# Altium project ESP+CM3.PrjPcb
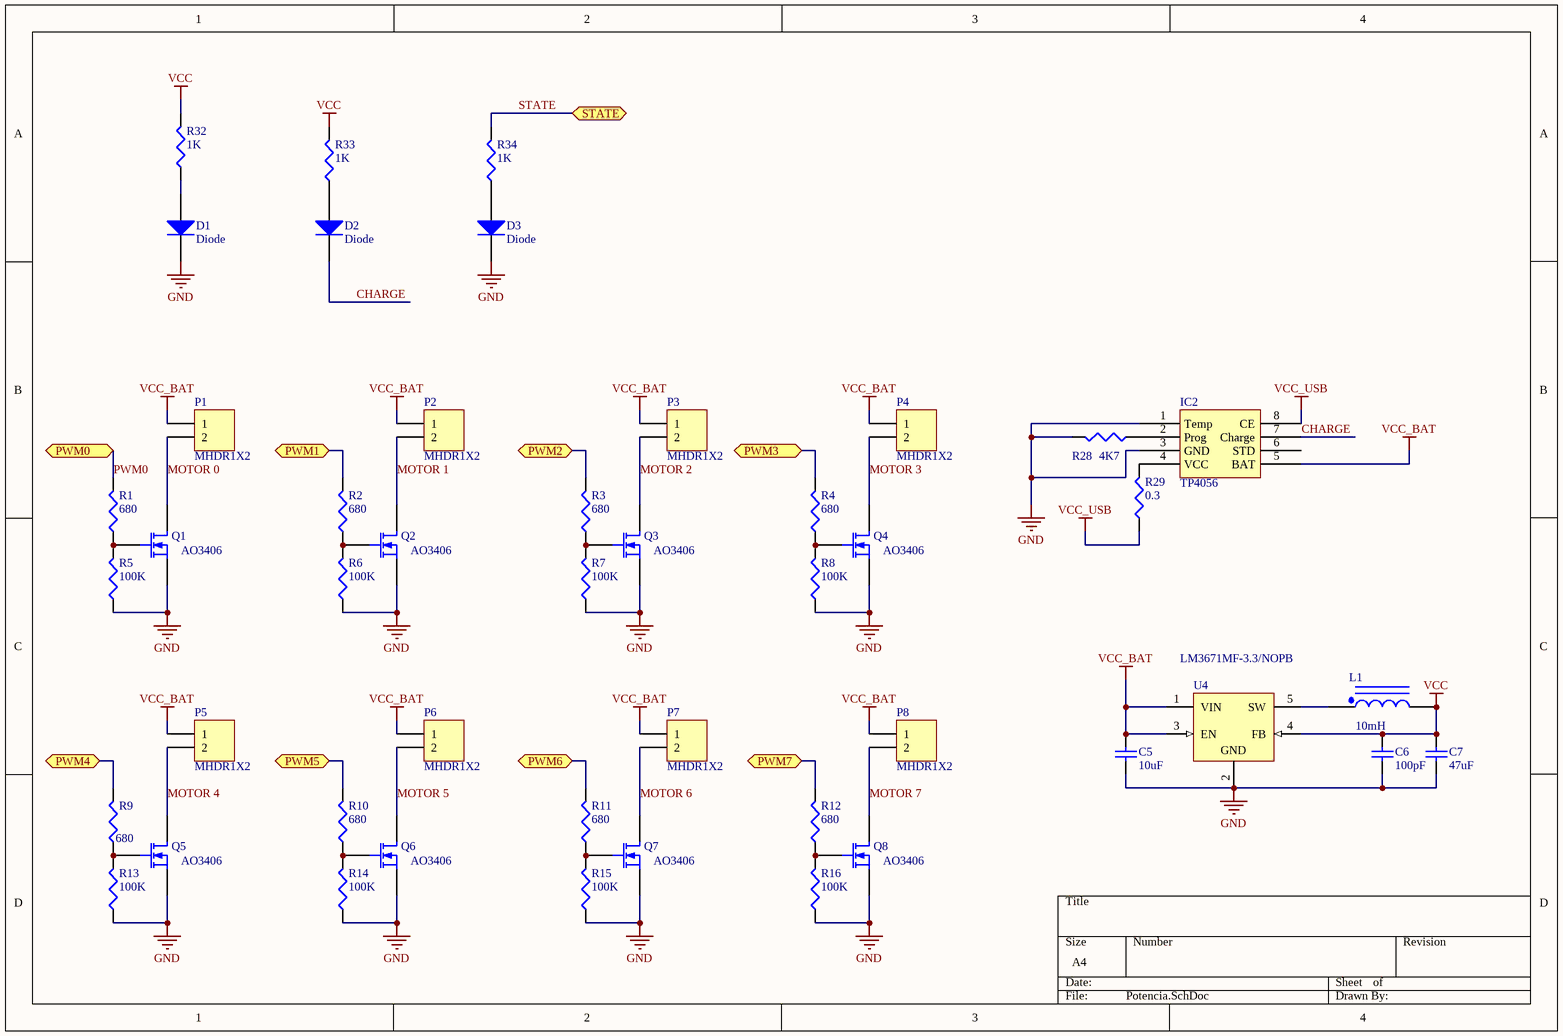
[diagram p0: Potencia.SchDoc]
2 sheets, 74 parts. Net scope: flat (ports and power ports of the same name join across sheets).
Board file: PCB_Final.PcbDoc
Sheets:
  Potencia.SchDoc
  Esquematico.SchDoc

## Sheet Potencia.SchDoc
size A4

### Parts
C5  value 10uF  [6-0805_L]  (hidden comment: Cap)
C6  value 100pF  [6-0805_L]  (hidden comment: Cap)
C7  value 47uF  [6-0805_L]  (hidden comment: Cap)
D1  Diode  [LED-0805]
D2  Diode  [LED-0805]
D3  Diode  [LED-0805]
IC2  TP4056  [SOIC127P600X175-8AN]
L1  value 10mH  [Inductor CD43]  (hidden comment: Inductor Iron Dot)
P1  MHDR1X2  [MHDR1X2]
P2  MHDR1X2  [MHDR1X2]
P3  MHDR1X2  [MHDR1X2]
P4  MHDR1X2  [MHDR1X2]
P5  MHDR1X2  [MHDR1X2]
P6  MHDR1X2  [MHDR1X2]
P7  MHDR1X2  [MHDR1X2]
P8  MHDR1X2  [MHDR1X2]
Q1  AO3406  [SOT23-3]
Q2  AO3406  [SOT23-3]
Q3  AO3406  [SOT23-3]
Q4  AO3406  [SOT23-3]
Q5  AO3406  [SOT23-3]
Q6  AO3406  [SOT23-3]
Q7  AO3406  [SOT23-3]
Q8  AO3406  [SOT23-3]
R1  value 680  [6-0805_N]  (hidden comment: Res3)
R2  value 680  [6-0805_N]  (hidden comment: Res3)
R3  value 680  [6-0805_N]  (hidden comment: Res3)
R4  value 680  [6-0805_N]  (hidden comment: Res3)
R5  value 100K  [6-0805_N]  (hidden comment: Res3)
R6  value 100K  [6-0805_N]  (hidden comment: Res3)
R7  value 100K  [6-0805_N]  (hidden comment: Res3)
R8  value 100K  [6-0805_N]  (hidden comment: Res3)
R9  value 680  [6-0805_N]  (hidden comment: Res3)
R10  value 680  [6-0805_N]  (hidden comment: Res3)
R11  value 680  [6-0805_N]  (hidden comment: Res3)
R12  value 680  [6-0805_N]  (hidden comment: Res3)
R13  value 100K  [6-0805_N]  (hidden comment: Res3)
R14  value 100K  [6-0805_N]  (hidden comment: Res3)
R15  value 100K  [6-0805_N]  (hidden comment: Res3)
R16  value 100K  [6-0805_N]  (hidden comment: Res3)
R28  value 4K7  [6-0805_N]  (hidden comment: Res3)
R29  value 0.3  [C1206]  (hidden comment: Res3)
R32  value 1K  [6-0805_N]  (hidden comment: Res3)
R33  value 1K  [6-0805_N]  (hidden comment: Res3)
R34  value 1K  [6-0805_N]  (hidden comment: Res3)
U4  LM3671MF-3.3/NOPB  [MF05A_N]

### Ports
PWM0, PWM1, PWM2, PWM3, PWM4, PWM5, PWM6, PWM7, STATE

### Nets
GND: C5.1 C6.1 C7.1 D1.2(K) D3.2(K) IC2.1(Temp) IC2.3(GND) Q1.3(S) Q2.3(S) Q3.3(S) Q4.3(S) Q5.3(S) Q6.3(S) Q7.3(S) Q8.3(S) R5.1 R6.1 R7.1 R8.1 R13.1 R14.1 R15.1 R16.1 R28.2 U4.2(GND)
VCC: C6.2 C7.2 L1.2 R32.2 R33.2 U4.4(FB)
VCC_BAT: C5.2 IC2.5(BAT) P1.1 P2.1 P3.1 P4.1 P5.1 P6.1 P7.1 P8.1 U4.1(VIN) U4.3(EN)
VCC_USB: IC2.8(CE) R29.1
CHARGE: D2.2(K) IC2.7(Charge)
MOTOR 0: P1.2 Q1.1(D)
MOTOR 1: P2.2 Q2.1(D)
MOTOR 2: P3.2 Q3.1(D)
MOTOR 3: P4.2 Q4.1(D)
MOTOR 4: P5.2 Q5.1(D)
MOTOR 5: P6.2 Q6.1(D)
MOTOR 6: P7.2 Q7.1(D)
MOTOR 7: P8.2 Q8.1(D)
PWM0: R1.2 ; port PWM0
PWM1: R2.2 ; port PWM1
PWM2: R3.2 ; port PWM2
PWM3: R4.2 ; port PWM3
PWM4: R9.2 ; port PWM4
PWM5: R10.2 ; port PWM5
PWM6: R11.2 ; port PWM6
PWM7: R12.2 ; port PWM7
STATE: R34.2 ; port STATE
NetD1_1: D1.1(A) R32.1
NetD2_1: D2.1(A) R33.1
NetD3_1: D3.1(A) R34.1
NetIC2_2: IC2.2(Prog) R28.1
NetIC2_4: IC2.4(VCC) R29.2
NetL1_1: L1.1 U4.5(SW)
NetQ1_2: Q1.2(G) R1.1 R5.2
NetQ2_2: Q2.2(G) R2.1 R6.2
NetQ3_2: Q3.2(G) R3.1 R7.2
NetQ4_2: Q4.2(G) R4.1 R8.2
NetQ5_2: Q5.2(G) R9.1 R13.2
NetQ6_2: Q6.2(G) R10.1 R14.2
NetQ7_2: Q7.2(G) R11.1 R15.2
NetQ8_2: Q8.2(G) R12.1 R16.2

Not connected (* = marked no-connect by the designer): IC2 6(STD)

### Library data of the parts
C5-C7 = Cap: Capacitor; Published: 8-Jun-2000; LatestRevisionDate: 17-Jul-2002; LatestRevisionNote: Re-released for DXP Platform.; PackageReference: RAD-0.3; Publisher: Altium Limited; PackageDescription: Radial Cap, Thru-Hole; 2 Leads; 0.3 in Pin Spacing
D1-D3 = Diode: Default Diode; Published: 8-Jun-2000; LatestRevisionDate: 17-Jul-2002; LatestRevisionNote: Re-released for DXP Platform.; PackageVersion: Sep-1996; PackageReference: SMC; Publisher: Altium Limited; PackageDescription: DO-214-AB/SMC; 2 C-Bend Leads; Body 7.9 x 5.9 mm, inc. leads (LxW); Code_JEDEC: DO-214-AB
L1 = Inductor Iron Dot: Magnetic-Core Inductor with Winding Polarity Marking; Published: 24-Mar-1999; LatestRevisionDate: 17-Jul-2002; LatestRevisionNote: Re-released for DXP Platform.; PackageReference: DIODE_SMC; Publisher: Altium Limited; PackageDescription: Diode; 2 Leads
P1-P8 = MHDR1X2: Header, 2-Pin; LatestRevisionDate: 17-Jul-2002; LatestRevisionNote: Re-released for DXP Platform.; Publisher: Altium Limited
Q1-Q8 = MOSFET-N: N-Channel MOSFET; pin to pad: 1>3 2>1 3>2; Published: 8-Jun-2000; LatestRevisionDate: 17-Jul-2002; LatestRevisionNote: Re-released for DXP Platform.; PackageVersion: 1995/1996; PackageReference: E3; Publisher: Altium Limited; PackageDescription: TO, Flat Index; 3 In-Line, Axial Leads; Body Dia. 4.6mm; Lead Dia. 0.5 mm (max)
R1-R16 R28 R29 R32-R34 = Res3: Resistor; Published: 8-Jun-2000; LatestRevisionDate: 29-May-2009; LatestRevisionNote: IPC-7351 Footprint Added.; PackageReference: J1-0603; Publisher: Altium Limited; PackageDescription: Chip Resistor
U4 = LM3671MF-3.3/NOPB: 2MHz, 600mA Step-Down DC-DC Converter, 5-pin SOT-23, Pb-Free; Manufacturer: National Semiconductor; PackageTopMarking: SJEB*XTT; PowerWise: Y; CompType: MiscPower; Published: 1-Mar-2010; DatasheetVersion: Oct-2008; PackageVersion: revD, Aug-2008; PackageReference: MF05A; Publisher: Altium Limited; PackageDescription: Molded SOT-23, .115 x .063 x .040 in Body, 5 Lead, .0375 in Pitch; Supplier 1: Digi-Key; Supplier Part Number 1: LM3671MF-3.3TR-ND; Supplier 2: Digi-Key; Supplier Part Number 2: LM3671MF-3.3CT-ND; Supplier 3: Digi-Key; Supplier Part Number 3: LM3671MF-3.3DKR-ND; Supplier 4: Farnell; Supplier Part Number 4: 1685767; PartNumber: LM3671MF-3.3/NOPB; RoHS: Y; PinCount: 5; ComponentLink1Description: LM3671 Datasheet; ComponentLink1URL: http://www.national.com/ds/LM/LM3671.pdf; ComponentLink2Description: LM3671 Web Page; ComponentLink2URL: http://www.national.com/pf/LM/LM3671.html; ComponentLink3Description: MF05A Package Page; ComponentLink3URL: http://www.national.com/packaging/folders/mf05a.html

## Sheet Esquematico.SchDoc
size A4
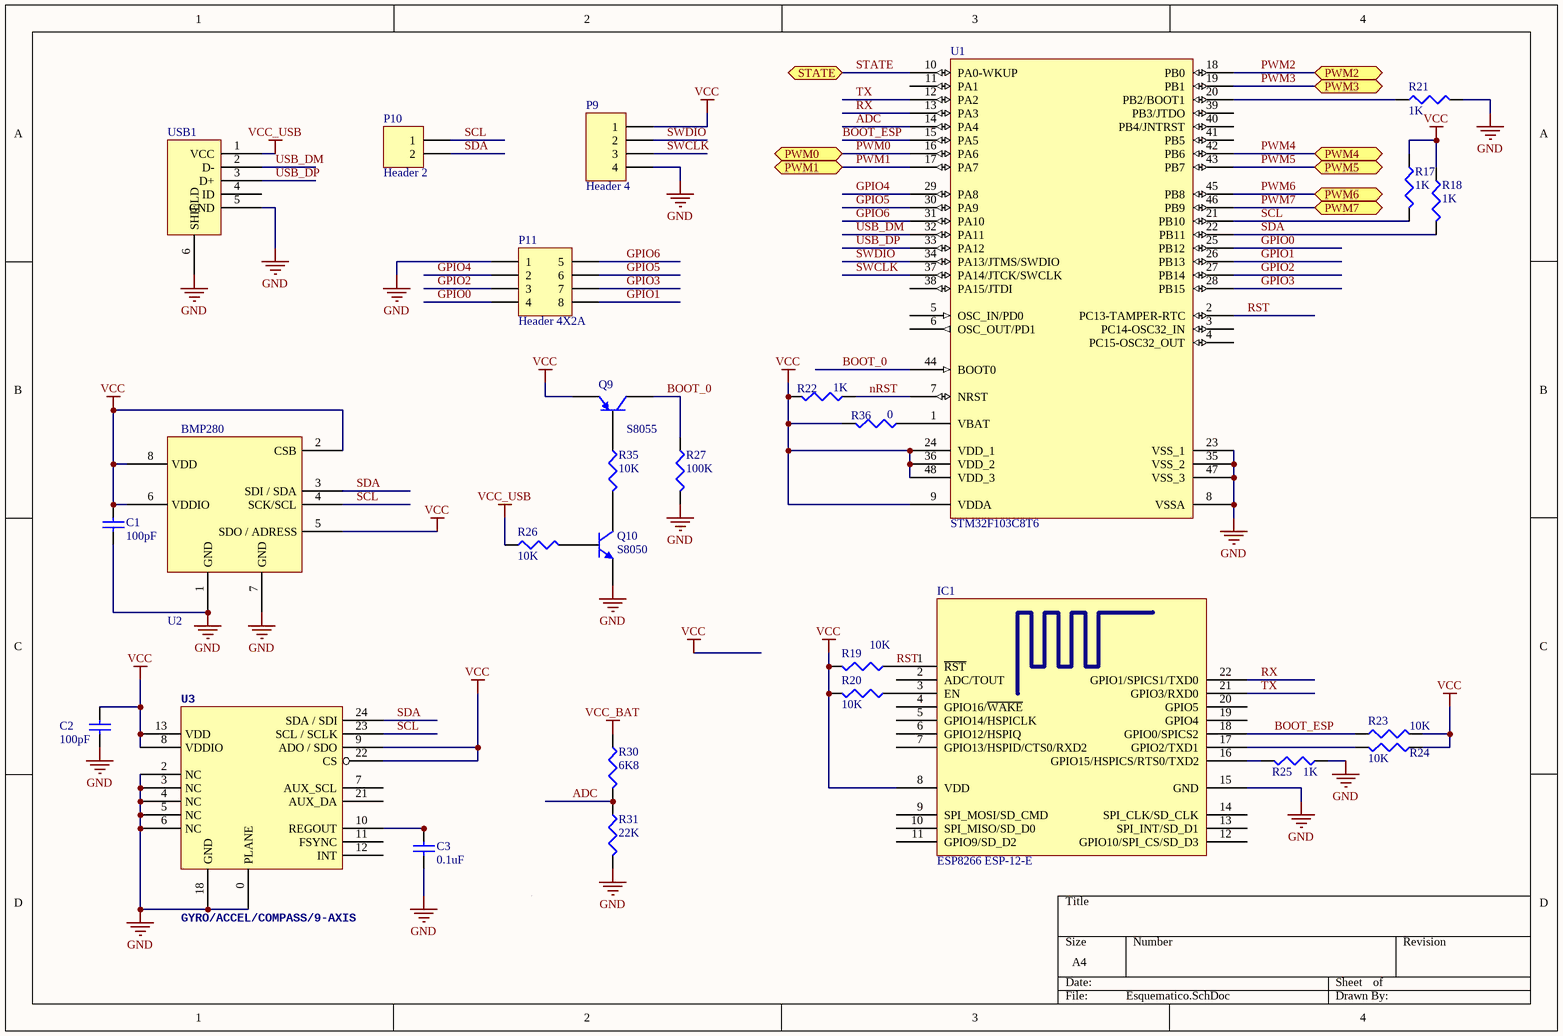
[diagram p1: Esquematico.SchDoc]

### Parts
C1  value 100pF  [6-0805_L]  (hidden comment: Cap)
C2  value 100pF  [C1206]  (hidden comment: Cap)
C3  value 0.1uF  [C1206]  (hidden comment: Cap)
IC1  ESP8266 ESP-12-E  [ESP8266 ESP-12-E B]
P9  Header 4  [HDR1X4]
P10  Header 2  [HDR1X2]
P11  Header 4X2A  [HDR2X4_CEN]
Q9  S8055  [SOT23-3]
Q10  S8050  [SOT23-3]
R17  value 1K  [C1206]  (hidden comment: Res3)
R18  value 1K  [C1206]  (hidden comment: Res3)
R19  value 10K  [6-0805_N]  (hidden comment: Res3)
R20  value 10K  [6-0805_N]  (hidden comment: Res3)
R21  value 1K  [C1206]  (hidden comment: Res3)
R22  value 1K  [6-0805_N]  (hidden comment: Res3)
R23  value 10K  [6-0805_N]  (hidden comment: Res3)
R24  value 10K  [6-0805_N]  (hidden comment: Res3)
R25  value 1K  [6-0805_N]  (hidden comment: Res3)
R26  value 10K  [6-0805_N]  (hidden comment: Res3)
R27  value 100K  [6-0805_N]  (hidden comment: Res3)
R30  value 6K8  [6-0805_N]  (hidden comment: Res3)
R31  value 22K  [6-0805_N]  (hidden comment: Res3)
R35  value 10K  [6-0805_N]  (hidden comment: Res3)
R36  value 0  [6-0805_N]  (hidden comment: Res3)
U1  STM32F103C8T6  [LQFP48_N]
U2  BMP280  [LGA-8_BMP280(Primary)]
U3  GYRO/ACCEL/COMPASS/9-AXIS  [QFN-24/3MM]
USB1  Micro_USB  [Micro USB]  (value not drawn)

### Ports
PWM0, PWM1, PWM2, PWM3, PWM4, PWM5, PWM6, PWM7, STATE

### Nets
GND: C1.1 C2.1 C3.1 IC1.15(GND) P9.4 P11.1 Q10.2(E) R21.2 R25.1 R27.2 R31.2 U1.8(VSSA) U1.23(VSS_1) U1.35(VSS_2) U1.47(VSS_3) U2.1(GND) U2.7(GND) U3.0(PLANE) U3.2(NC) U3.3(NC) U3.4(NC) U3.5(NC) U3.6(NC) U3.18(GND) USB1.5(GND) USB1.6(SHIELD)
VCC: C1.2 C2.2 IC1.8(VDD) P9.1 Q9.2(E) R17.1 R18.1 R19.2 R20.2 R22.2 R23.2 R24.1 R36.2 U1.9(VDDA) U1.24(VDD_1) U1.36(VDD_2) U1.48(VDD_3) U2.2(CSB) U2.5(SDO_/_ADRESS) U2.6(VDDIO) U2.8(VDD) U3.8(VDDIO) U3.9(ADO_/_SDO) U3.13(VDD) U3.22(CS)
VCC_BAT: R30.1
VCC_USB: R26.1 USB1.1(VCC)
ADC: R30.2 R31.1 U1.14(PA4)
BOOT_0: Q9.3(C) R27.1 U1.44(BOOT0)
BOOT_ESP: IC1.18(GPIO0/SPICS2) R23.1 U1.15(PA5)
GPIO0: P11.4 U1.25(PB12)
GPIO1: P11.8 U1.26(PB13)
GPIO2: P11.3 U1.27(PB14)
GPIO3: P11.7 U1.28(PB15)
GPIO4: P11.2 U1.29(PA8)
GPIO5: P11.6 U1.30(PA9)
GPIO6: P11.5 U1.31(PA10)
nRST: R22.1 U1.7(NRST)
PWM0: U1.16(PA6) ; port PWM0
PWM1: U1.17(PA7) ; port PWM1
PWM2: U1.18(PB0) ; port PWM2
PWM3: U1.19(PB1) ; port PWM3
PWM4: U1.42(PB6) ; port PWM4
PWM5: U1.43(PB7) ; port PWM5
PWM6: U1.45(PB8) ; port PWM6
PWM7: U1.46(PB9) ; port PWM7
RST: IC1.1(~{RST}) R19.1 U1.2(PC13-TAMPER-RTC)
RX: IC1.22(GPIO1/SPICS1/TXD0) U1.13(PA3)
SCL: P10.1 R17.2 U1.21(PB10) U2.4(SCK/SCL) U3.23(SCL_/_SCLK)
SDA: P10.2 R18.2 U1.22(PB11) U2.3(SDI_/_SDA) U3.24(SDA_/_SDI)
STATE: U1.10(PA0-WKUP) ; port STATE
SWCLK: P9.3 U1.37(PA14/JTCK/SWCLK)
SWDIO: P9.2 U1.34(PA13/JTMS/SWDIO)
TX: IC1.21(GPIO3/RXD0) U1.12(PA2)
USB_DM: U1.32(PA11) USB1.2(D-)
USB_DP: U1.33(PA12) USB1.3(D+)
NetC3_2: C3.2 U3.10(REGOUT)
NetIC1_3: IC1.3(EN) R20.1
NetIC1_16: IC1.16(GPIO15/HSPICS/RTS0/TXD2) R25.2
NetIC1_17: IC1.17(GPIO2/TXD1) R24.2
NetQ9_1: Q9.1(B) R35.1
NetQ10_1: Q10.1(B) R26.2
NetQ10_3: Q10.3(C) R35.2
NetR21_1: R21.1 U1.20(PB2/BOOT1)
NetR36_1: R36.1 U1.1(VBAT)

Not connected (* = marked no-connect by the designer): IC1 2(ADC/TOUT) 4(GPIO16/~{WAKE}) 5(GPIO14/HSPICLK) 6(GPIO12/HSPIQ) 7(GPIO13/HSPID/CTS0/RXD2) 9(SPI_MOSI/SD_CMD) 10(SPI_MISO/SD_D0) 11(GPIO9/SD_D2) 12(GPIO10/SPI_CS/SD_D3) 13(SPI_INT/SD_D1) 14(SPI_CLK/SD_CLK) 19(GPIO4) 20(GPIO5); U1 3(PC14-OSC32_IN) 4(PC15-OSC32_OUT) 5(OSC_IN/PD0) 6(OSC_OUT/PD1) 11(PA1) 38(PA15/JTDI) 39(PB3/JTDO) 40(PB4/JNTRST) 41(PB5); U3 7(AUX_SCL) 11(FSYNC) 12(INT) 21(AUX_DA); USB1 4(ID)

### Library data of the parts
C1-C3 = Cap: Capacitor; Published: 8-Jun-2000; LatestRevisionDate: 17-Jul-2002; LatestRevisionNote: Re-released for DXP Platform.; PackageReference: RAD-0.3; Publisher: Altium Limited; PackageDescription: Radial Cap, Thru-Hole; 2 Leads; 0.3 in Pin Spacing
P9 = Header 4: Header, 4-Pin; LatestRevisionDate: 17-Jul-2002; LatestRevisionNote: Re-released for DXP Platform.; Publisher: Altium Limited
P10 = Header 2: Header, 2-Pin; LatestRevisionDate: 17-Jul-2002; LatestRevisionNote: Re-released for DXP Platform.; Publisher: Altium Limited
P11 = Header 4X2A: Header, 4-Pin, Dual row; LatestRevisionDate: 17-Jul-2002; LatestRevisionNote: Re-released for DXP Platform.; Publisher: Altium Limited
Q9 = S8055: PNP SMD General Purpose Amplifier; Published: 8-Jun-2000; LatestRevisionDate: 15-Jan-2003; LatestRevisionNote: PCB Footprint 'BCY-W3/D4.7' replaced; DatasheetVersion: 1997; PackageVersion: Sep-1998; PackageReference: TO-92A; Publisher: Altium Limited; PackageDescription: TO, Flat Index; 3 In-Line, Axial Leads; Body Dia. 4.5mm; Leads 0.51 x 0.48 mm (max); ComponentLink1Description: Manufacturer Link; ComponentLink1URL: http://www.fairchildsemi.com/; ComponentLink2Description: Datasheet; ComponentLink2URL: http://www.fairchildsemi.com/ds/2N%2F2N3906.pdf
Q10 = S8050: NPN SMD General Purpose Amplifier; Published: 8-Jun-2000; LatestRevisionDate: 15-Jan-2003; LatestRevisionNote: PCB Footprint 'BCY-W3/D4.7' replaced; DatasheetVersion: 1997; PackageVersion: Sep-1998; PackageReference: TO-92A; Publisher: Altium Limited; PackageDescription: TO, Flat Index; 3 In-Line, Axial Leads; Body Dia. 4.5mm; Leads 0.51 x 0.48 mm (max); ComponentLink1Description: Manufacturer Link; ComponentLink1URL: http://www.fairchildsemi.com/; ComponentLink2Description: Datasheet; ComponentLink2URL: http://www.fairchildsemi.com/ds/2N%2F2N3904.pdf
R17-R27 R30 R31 R35 R36 = Res3: Resistor; Published: 8-Jun-2000; LatestRevisionDate: 29-May-2009; LatestRevisionNote: IPC-7351 Footprint Added.; PackageReference: J1-0603; Publisher: Altium Limited; PackageDescription: Chip Resistor
U1 = STM32F103C8T6: STM32 ARM-based 32-bit MCU with 64 Kbytes Flash, 48-pin LQFP, Industrial Temperature; Published: 30-May-2008; DatasheetVersion: rev6, Mar-2008; PackageVersion: Mar-2008; PackageReference: LQFP48; Publisher: Altium Limited; PackageDescription: 48-Pin Low-Profile Quad Flat Pack, 7 x 7 mm Body, 0.5 mm Pitch (LQFP48); ComponentLink1Description: Manufacturer Link; ComponentLink1URL: www.st.com/stm32; ComponentLink2Description: Datasheet; ComponentLink2URL: http://www.st.com/stonline/products/literature/ds/13587.pdf
U2 = BMP280: Barometro; Value: *
U3 = MPU-9250

## Nets that join several sheets
GND: Potencia (25 pins), Esquematico (26 pins)
VCC: Potencia (6 pins), Esquematico (25 pins)
VCC_BAT: Potencia (12 pins), Esquematico (R30.1)
VCC_USB: Potencia (IC2.8 R29.1), Esquematico (R26.1 USB1.1)
PWM0: Potencia (R1.2), Esquematico (U1.16)
PWM1: Potencia (R2.2), Esquematico (U1.17)
PWM2: Potencia (R3.2), Esquematico (U1.18)
PWM3: Potencia (R4.2), Esquematico (U1.19)
PWM4: Potencia (R9.2), Esquematico (U1.42)
PWM5: Potencia (R10.2), Esquematico (U1.43)
PWM6: Potencia (R11.2), Esquematico (U1.45)
PWM7: Potencia (R12.2), Esquematico (U1.46)
STATE: Potencia (R34.2), Esquematico (U1.10)